# Altium schematic sheet Relay.SchDoc
size A4
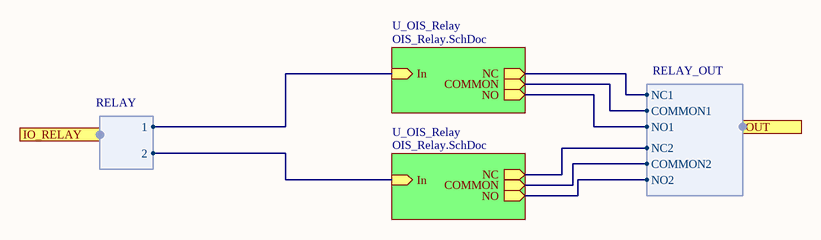
[diagram p0: Relay.SchDoc]

## Sub-sheets
U_OIS_Relay = OIS_Relay.SchDoc: In (in), COMMON (out), NC (out), NO (out)
U_OIS_Relay = OIS_Relay.SchDoc: In (in), COMMON (out), NC (out), NO (out)

## Ports
IO_RELAY (harness RELAY), OUT (harness RELAY_OUT)

## Harnesses
RELAY: 1, 2
RELAY_OUT: COMMON1, NC1, NO1, NC2, COMMON2, NO2

## Nets
(unnamed): sheet U_OIS_Relay/In, port IO_RELAY.1
(unnamed): sheet U_OIS_Relay/COMMON, port OUT.COMMON1
(unnamed): sheet U_OIS_Relay/NC, port OUT.NC1
(unnamed): sheet U_OIS_Relay/NO, port OUT.NO1
(unnamed): sheet U_OIS_Relay/In, port IO_RELAY.2
(unnamed): sheet U_OIS_Relay/COMMON, port OUT.COMMON2
(unnamed): sheet U_OIS_Relay/NC, port OUT.NC2
(unnamed): sheet U_OIS_Relay/NO, port OUT.NO2